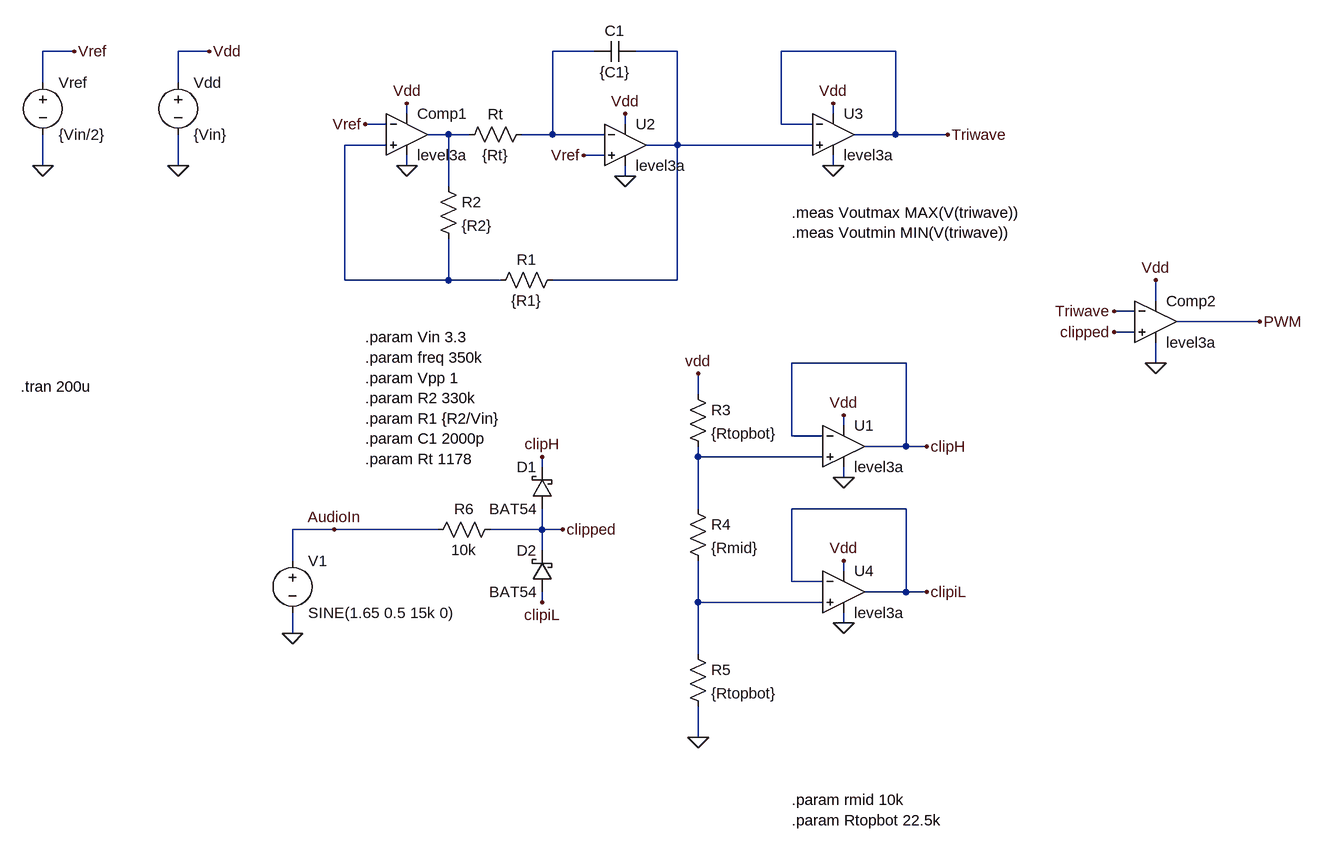
[diagram p0: schematic pwm_gen.asc]
pwm_gen.asc, the LTspice schematic file:
Version 4
SHEET 1 1404 1308
WIRE -496 112 -544 112
WIRE -288 112 -336 112
WIRE 304 112 240 112
WIRE 432 112 368 112
WIRE 768 112 592 112
WIRE -544 160 -544 112
WIRE -336 160 -336 112
WIRE 16 208 16 192
WIRE 672 208 672 192
WIRE -16 224 -48 224
WIRE 352 224 352 208
WIRE 592 224 592 112
WIRE 640 224 592 224
WIRE 80 240 48 240
WIRE 112 240 80 240
WIRE 240 240 240 112
WIRE 240 240 192 240
WIRE 320 240 240 240
WIRE 768 240 768 112
WIRE 768 240 704 240
WIRE 848 240 768 240
WIRE -16 256 -80 256
WIRE 432 256 432 112
WIRE 432 256 384 256
WIRE 640 256 432 256
WIRE 320 272 288 272
WIRE -544 288 -544 240
WIRE -336 288 -336 240
WIRE 16 288 16 272
WIRE 672 288 672 272
WIRE 352 304 352 288
WIRE 80 320 80 240
WIRE -80 464 -80 256
WIRE 80 464 80 400
WIRE 80 464 -80 464
WIRE 160 464 80 464
WIRE 432 464 432 256
WIRE 432 464 240 464
WIRE 1168 496 1168 464
WIRE 1136 512 1104 512
WIRE 1328 528 1200 528
WIRE 1136 544 1104 544
WIRE 784 592 608 592
WIRE 1168 592 1168 560
WIRE 464 640 464 608
WIRE 688 688 688 672
WIRE 608 704 608 592
WIRE 656 704 608 704
WIRE 784 720 784 592
WIRE 784 720 720 720
WIRE 816 720 784 720
WIRE 464 736 464 720
WIRE 656 736 464 736
WIRE 224 752 224 736
WIRE 688 768 688 752
WIRE 464 816 464 736
WIRE 784 816 608 816
WIRE -96 848 -160 848
WIRE 64 848 -96 848
WIRE 224 848 224 816
WIRE 224 848 144 848
WIRE 256 848 224 848
WIRE 224 880 224 848
WIRE -160 896 -160 848
WIRE 688 912 688 896
WIRE 608 928 608 816
WIRE 656 928 608 928
WIRE 784 944 784 816
WIRE 784 944 720 944
WIRE 816 944 784 944
WIRE 224 960 224 944
WIRE 464 960 464 896
WIRE 656 960 464 960
WIRE 688 992 688 976
WIRE -160 1008 -160 976
WIRE 464 1040 464 960
WIRE 464 1168 464 1120
FLAG -544 288 0
FLAG -336 288 0
FLAG -496 112 Vref
FLAG -288 112 Vdd
FLAG 16 192 Vdd
FLAG 352 208 Vdd
FLAG 672 192 Vdd
FLAG 16 288 0
FLAG 352 304 0
FLAG 672 288 0
FLAG -48 224 Vref
FLAG 288 272 Vref
FLAG 848 240 Triwave
FLAG -160 1008 0
FLAG -96 848 AudioIn
FLAG 464 1168 0
FLAG 464 608 vdd
FLAG 256 848 clipped
FLAG 688 672 Vdd
FLAG 688 768 0
FLAG 688 896 Vdd
FLAG 688 992 0
FLAG 816 720 clipH
FLAG 816 944 clipiL
FLAG 224 736 clipH
FLAG 224 960 clipiL
FLAG 1104 512 Triwave
FLAG 1104 544 clipped
FLAG 1168 464 Vdd
FLAG 1168 592 0
FLAG 1328 528 PWM
SYMBOL OpAmps\\UniversalOpAmp3 16 240 R0
SYMATTR InstName Comp1
SYMATTR Value2 Avol=10Meg GBW=10Meg Slew=500Meg
SYMATTR SpiceLine Ilimit=50m Rail=0 Vos=0 Phimargin=45
SYMBOL OpAmps\\UniversalOpAmp3 352 256 R0
SYMATTR InstName U2
SYMATTR Value2 Avol=1Meg GBW=10Meg Slew=150Meg
SYMBOL OpAmps\\UniversalOpAmp3 672 240 R0
SYMATTR InstName U3
SYMBOL voltage -336 144 R0
WINDOW 123 0 0 Left 0
WINDOW 39 0 0 Left 0
SYMATTR InstName Vdd
SYMATTR Value {Vin}
SYMBOL voltage -544 144 R0
WINDOW 123 0 0 Left 0
WINDOW 39 0 0 Left 0
SYMATTR InstName Vref
SYMATTR Value {Vin/2}
SYMBOL res 64 304 R0
SYMATTR InstName R2
SYMATTR Value {R2}
SYMBOL res 256 448 R90
WINDOW 0 0 56 VBottom 2
WINDOW 3 32 56 VTop 2
SYMATTR InstName R1
SYMATTR Value {R1}
SYMBOL res 96 256 R270
WINDOW 0 32 56 VTop 2
WINDOW 3 0 56 VBottom 2
SYMATTR InstName Rt
SYMATTR Value {Rt}
SYMBOL cap 368 96 R90
WINDOW 0 0 32 VBottom 2
WINDOW 3 32 32 VTop 2
SYMATTR InstName C1
SYMATTR Value {C1}
SYMBOL voltage -160 880 R0
WINDOW 123 0 0 Left 0
WINDOW 39 0 0 Left 0
SYMATTR InstName V1
SYMATTR Value SINE(1.65 0.5 15k 0)
SYMBOL schottky 240 944 R180
WINDOW 0 24 64 Left 2
WINDOW 3 24 0 Left 2
SYMATTR InstName D2
SYMATTR Value BAT54
SYMATTR Description Diode
SYMATTR Type diode
SYMBOL res 448 624 R0
SYMATTR InstName R3
SYMATTR Value {Rtopbot}
SYMBOL res 448 800 R0
SYMATTR InstName R4
SYMATTR Value {Rmid}
SYMBOL res 448 1024 R0
SYMATTR InstName R5
SYMATTR Value {Rtopbot}
SYMBOL res 160 832 R90
WINDOW 0 0 56 VBottom 2
WINDOW 3 32 56 VTop 2
SYMATTR InstName R6
SYMATTR Value 10k
SYMBOL schottky 240 816 R180
WINDOW 0 24 64 Left 2
WINDOW 3 24 0 Left 2
SYMATTR InstName D1
SYMATTR Value BAT54
SYMATTR Description Diode
SYMATTR Type diode
SYMBOL OpAmps\\UniversalOpAmp3 688 720 R0
SYMATTR InstName U1
SYMBOL OpAmps\\UniversalOpAmp3 688 944 R0
SYMATTR InstName U4
SYMBOL OpAmps\\UniversalOpAmp3 1168 528 R0
SYMATTR InstName Comp2
SYMATTR Value2 Avol=10Meg GBW=500Meg Slew=50Meg
SYMATTR SpiceLine Ilimit=50m Rail=0 Vos=0 Phimargin=45
TEXT -48 552 Left 2 !.param Vin 3.3\n.param freq 350k\n.param Vpp 1\n.param R2 330k\n.param R1 {R2/Vin}\n.param C1 2000p\n.param Rt 1178
TEXT -578 628 Left 2 !.tran 200u
TEXT 608 360 Left 2 !.meas Voutmax MAX(V(triwave))\n.meas Voutmin MIN(V(triwave))
TEXT 608 1264 Left 2 !.param rmid 10k\n.param Rtopbot 22.5k

The netlist it stands for:
* pwm_gen.asc
XComp1 N004 Vref Vdd 0 N003 level3a Avol=10Meg GBW=10Meg Slew=500Meg Ilimit=50m Rail=0 Vos=0 Phimargin=45  ; pins In+ In- V+ V- OUT
XU2 Vref N001 Vdd 0 N002 level3a Avol=1Meg GBW=10Meg Slew=150Meg Ilimit=25m Rail=0 Vos=0 Phimargin=45 En=0 Enk=0 In=0 Ink=0 Rin=500Meg  ; pins In+ In- V+ V- OUT
XU3 N002 Triwave Vdd 0 Triwave level3a  ; pins In+ In- V+ V- OUT
Vdd Vdd 0 {Vin}
Vref Vref 0 {Vin/2}
R2 N003 N004 {R2}
R1 N002 N004 {R1}
Rt N003 N001 {Rt}
C1 N002 N001 {C1}
V1 AudioIn 0 SINE(1.65 0.5 15k 0)
D2 clipiL clipped BAT54
R3 Vdd N005 {Rtopbot}
R4 N005 N006 {Rmid}
R5 N006 0 {Rtopbot}
R6 clipped AudioIn 10k
D1 clipped clipH BAT54
XU1 N005 clipH Vdd 0 clipH level3a  ; pins In+ In- V+ V- OUT
XU4 N006 clipiL Vdd 0 clipiL level3a  ; pins In+ In- V+ V- OUT
XComp2 clipped Triwave Vdd 0 PWM level3a Avol=10Meg GBW=500Meg Slew=50Meg Ilimit=50m Rail=0 Vos=0 Phimargin=45  ; pins In+ In- V+ V- OUT
.model D D
.lib standard.dio
.param Vin 3.3
.param freq 350k
.param Vpp 1
.param R2 330k
.param R1 {R2/Vin}
.param C1 2000p
.param Rt 1178
.tran 200u
.meas Voutmax MAX(V(triwave))
.meas Voutmin MIN(V(triwave))
.param rmid 10k
.param Rtopbot 22.5k
.backanno
.end